# Altium project Moo1.1.PrjPcb
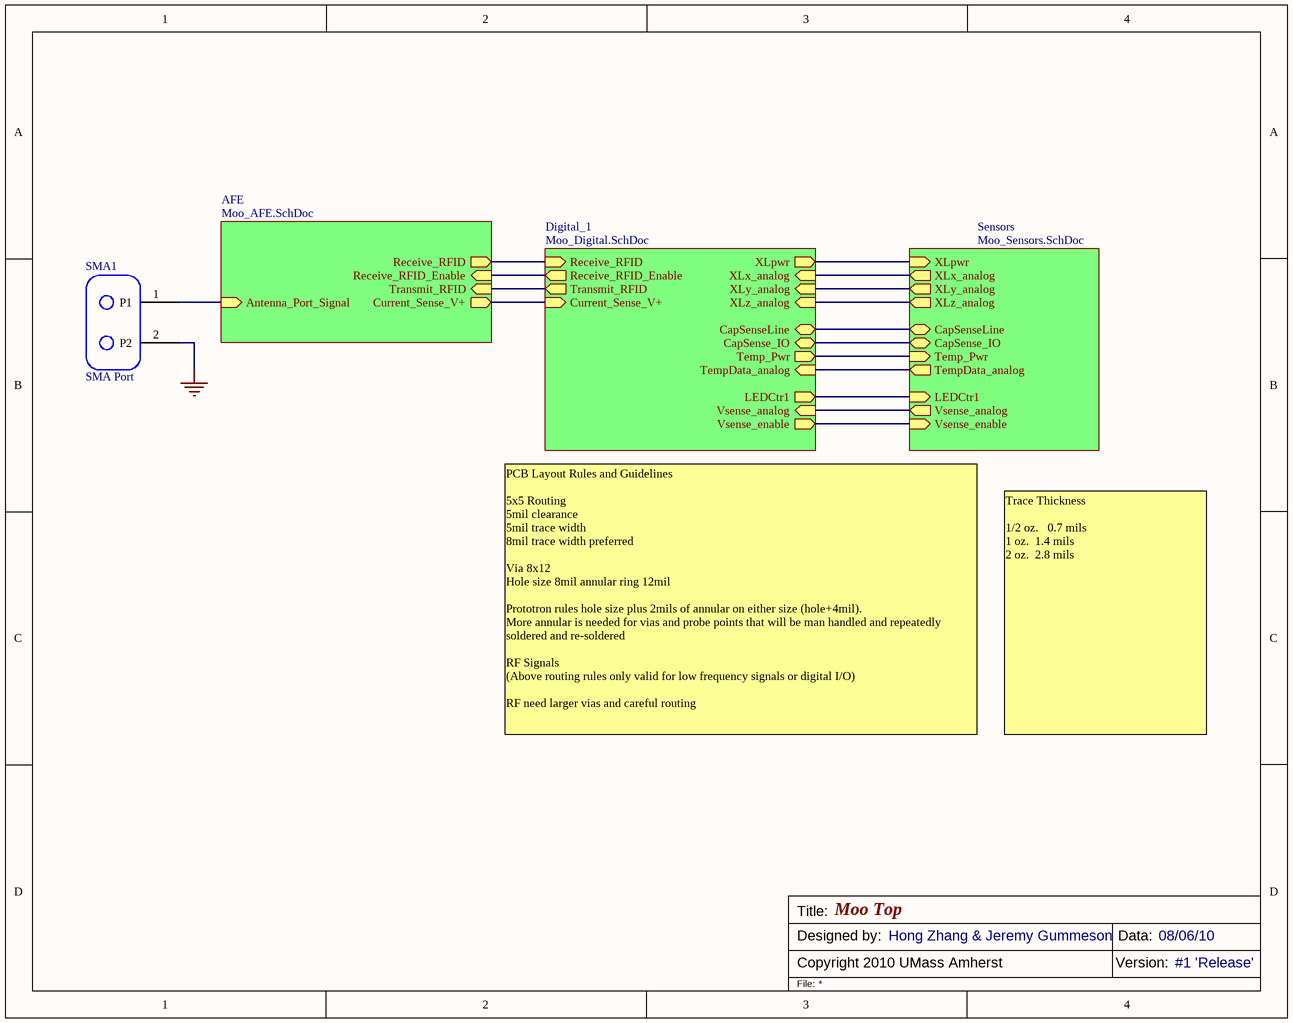
[diagram p0: Moo_Top.SchDoc]
3 sheets, 39 parts. Net scope: hierarchical (ports join the sheet entries above them; power ports are global).
Board files: Moo1.1.PcbDoc, Moo1.1_Ant.PcbDoc
Sheets:
  Moo_Top.SchDoc
    Sensors = Moo_Sensors.SchDoc
    Digital_1 = Moo_Digital.SchDoc

## Sheet Moo_Top.SchDoc
size A; Date: 7/01/09; Engineer: Alanson Sample & Dan Yeager; Revision: Release

### Parts
SMA1  SMA Port  [SMA Port]

### Sub-sheets
AFE = Moo_AFE.SchDoc (file not in this document): Receive_RFID (out), Receive_RFID_Enable (in), Transmit_RFID (in), Antenna_Port_Signal (in), Current_Sense_V+ (out)
Digital_1 = Moo_Digital.SchDoc: Receive_RFID (in), Receive_RFID_Enable (out), Transmit_RFID (out), XLpwr (out), XLx_analog (in), XLy_analog (in), XLz_analog (in), LEDCtr1 (out), Vsense_analog (in), Temp_Pwr (out), TempData_analog (in), CapSense_IO (bidir), Vsense_enable (out), CapSenseLine (bidir), Current_Sense_V+ (in)
Sensors = Moo_Sensors.SchDoc: XLpwr, XLx_analog (out), XLy_analog (out), XLz_analog (out), TempData_analog (out), Temp_Pwr, LEDCtr1 (in), Vsense_analog (out), CapSense_IO, Vsense_enable (in), CapSenseLine

### Nets
GND: SMA1.2(P2)
CapSense: sheet Sensors/CapSense_IO, sheet Digital_1/CapSense_IO
CapSenseLine: sheet Sensors/CapSenseLine, sheet Digital_1/CapSenseLine
LED_CTL_1: sheet Sensors/LEDCtr1, sheet Digital_1/LEDCtr1
P63_A3: sheet Sensors/TempData_analog, sheet Digital_1/TempData_analog
P64_A4: sheet Sensors/Vsense_analog, sheet Digital_1/Vsense_analog
Temp_Pwr: sheet Sensors/Temp_Pwr, sheet Digital_1/Temp_Pwr
VSENSE_ENABLE: sheet Sensors/Vsense_enable, sheet Digital_1/Vsense_enable
XLpwr: sheet Sensors/XLpwr, sheet Digital_1/XLpwr
XLx: sheet Sensors/XLx_analog, sheet Digital_1/XLx_analog
XLy: sheet Sensors/XLy_analog, sheet Digital_1/XLy_analog
XLz: sheet Sensors/XLz_analog, sheet Digital_1/XLz_analog
NetMCU1_13: sheet AFE/Transmit_RFID, sheet Digital_1/Transmit_RFID
NetMCU1_14: sheet AFE/Receive_RFID, sheet Digital_1/Receive_RFID
NetMCU1_15: sheet AFE/Receive_RFID_Enable, sheet Digital_1/Receive_RFID_Enable
NetP3_1: sheet AFE/Current_Sense_V+, sheet Digital_1/Current_Sense_V+
NetSMA1_1: SMA1.1(P1) ; sheet AFE/Antenna_Port_Signal

### Notes on the sheet
- PCB Layout Rules and Guidelines
  5x5 Routing
  5mil clearance
  5mil trace width
  8mil trace width preferred
  Via 8x12
  Hole size 8mil annular ring 12mil
  Prototron rules hole size plus 2mils of annular on either size (hole+4mil).
  More annular is needed for vias and probe points that will be man handled and repeatedly soldered and re-soldered
  RF Signals
  (Above routing rules only valid for low frequency signals or digital I/O)
  RF need larger vias and careful routing
- Trace Thickness
  1/2 oz.  	0.7 mils
  1 oz. 	1.4 mils
  2 oz. 	2.8 mils
- Title:
- Copyright 2010 UMass Amherst
- Designed by:
- Moo Top
- Hong Zhang & Jeremy Gummeson
- Version:
- Data:
- 08/06/10
- #1 'Release'
- File:

### Library data of the parts
SMA1 = SMA Port: Two pin SMA connector wisp; Value: Do Not Stuff

## Sheet Moo_Sensors.SchDoc
size A
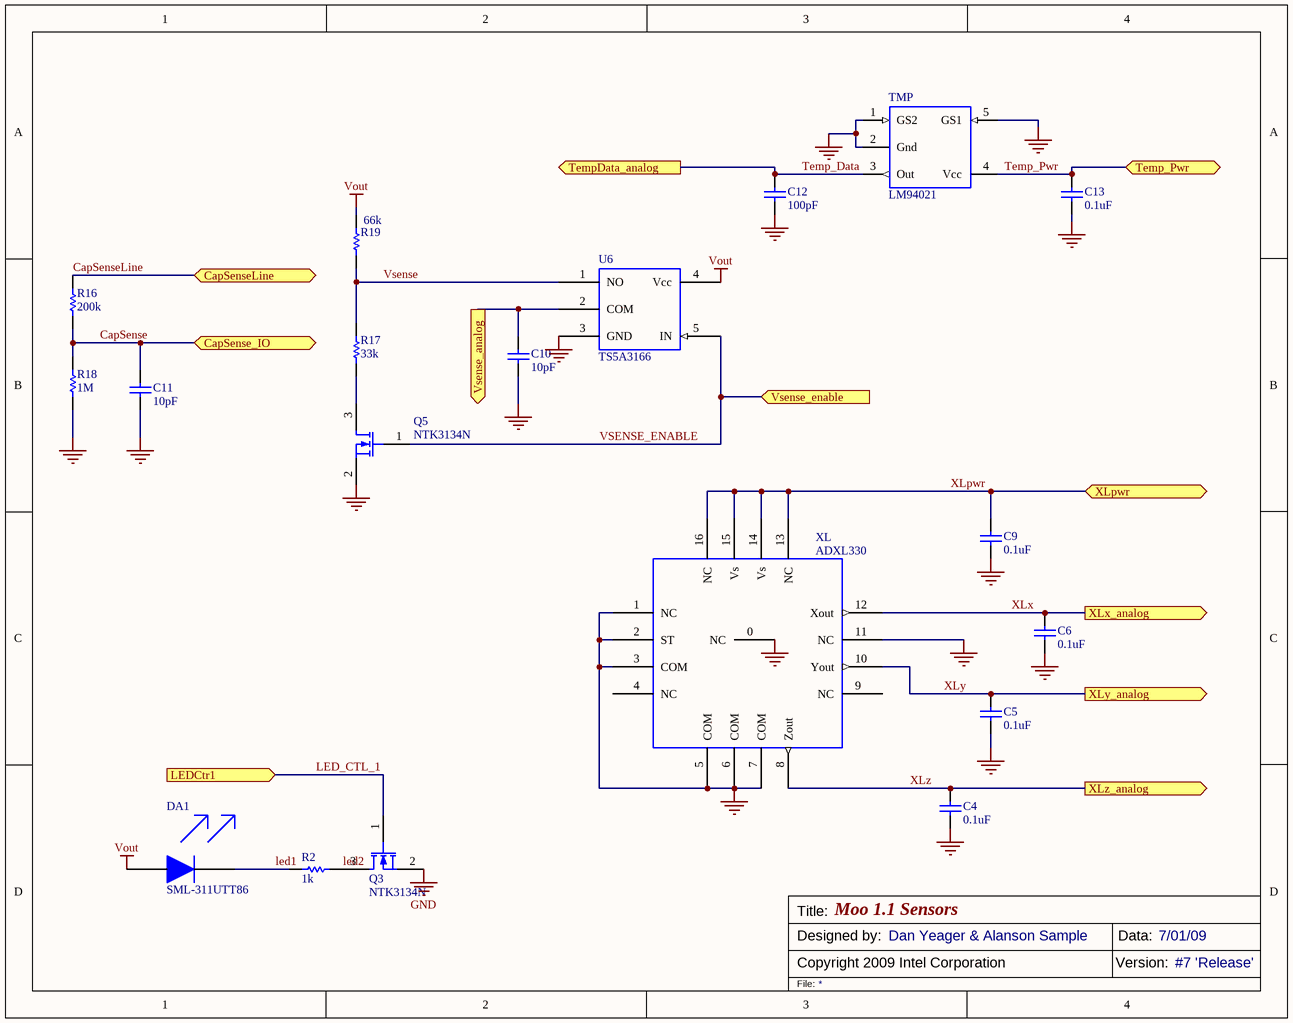
[diagram p1: Moo_Sensors.SchDoc]

### Parts
C4  value 0.1uF  [0402]  (hidden comment: Ceramic_Chip_Capacitor)
C5  value 0.1uF  [0402]  (hidden comment: Ceramic_Chip_Capacitor)
C6  value 0.1uF  [0402]  (hidden comment: Ceramic_Chip_Capacitor)
C9  value 0.1uF  [0402]  (hidden comment: Ceramic_Chip_Capacitor)
C10  value 10pF  [0402]  (hidden comment: Ceramic_Chip_Capacitor)
C11  value 10pF  [0402]  (hidden comment: Ceramic_Chip_Capacitor)
C12  value 100pF  [0402]  (hidden comment: Ceramic_Chip_Capacitor)
C13  value 0.1uF  [0402]  (hidden comment: Ceramic_Chip_Capacitor)
DA1  SML-311UTT86  [LED-0603]
Q3  NTK3134N  [SOT723]
Q5  NTK3134N  [SOT723]
R2  value 1k  [0402]  (hidden comment: Thick Film Chip Resistor)
R16  value 200k  [0402]  (hidden comment: Thick Film Chip Resistor)
R17  value 33k  [0402]  (hidden comment: Thick Film Chip Resistor)
R18  value 1M  [0402]  (hidden comment: Thick Film Chip Resistor)
R19  value 66k  [0402]  (hidden comment: Thick Film Chip Resistor)
TMP  LM94021  [SC70]
U6  TS5A3166  [sc70-5]
XL  ADXL330  [16-QFN]

### Ports
CapSense_IO, CapSenseLine, LEDCtr1 (in), Temp_Pwr, TempData_analog (out), Vsense_analog (out), Vsense_enable (in), XLpwr, XLx_analog (out), XLy_analog (out), XLz_analog (out)

### Nets
GND: C4.1 C5.1 C6.2 C9.1 C10.2 C11.2 C12.1 C13.1 Q3.2(S) Q5.2(S) R18.2 TMP.1(GS2) TMP.2(Gnd) TMP.5(GS1) U6.3(GND) XL.0(NC) XL.1(NC) XL.2(ST) XL.3(COM) XL.5(COM) XL.6(COM) XL.7(COM) XL.11(NC)
Vout: DA1.1 R19.1 U6.4(Vcc)
CapSense: C11.1 R16.2 R18.1 ; port CapSense_IO
CapSenseLine: R16.1 ; port CapSenseLine
led1: DA1.2 R2.1
led2: Q3.3(D) R2.2
LED_CTL_1: Q3.1(G) ; port LEDCtr1
P64_A4: C10.1 U6.2(COM) ; port Vsense_analog
Temp_Data: C12.2 TMP.3(Out) ; port TempData_analog  [project net P63_A3]
Temp_Pwr: C13.2 TMP.4(Vcc) ; port Temp_Pwr
Vsense: R17.1 R19.2 U6.1(NO)
VSENSE_ENABLE: Q5.1(G) U6.5(IN) ; port Vsense_enable
XLpwr: C9.2 XL.13(NC) XL.14(Vs) XL.15(Vs) XL.16(NC) ; port XLpwr
XLx: C6.1 XL.12(Xout) ; port XLx_analog
XLy: C5.2 XL.10(Yout) ; port XLy_analog
XLz: C4.2 XL.8(Zout) ; port XLz_analog
NetQ5_3: Q5.3(D) R17.2

Not connected (* = marked no-connect by the designer): XL 4(NC) 9(NC)

### Notes on the sheet
- Title:
- Copyright 2009 Intel Corporation
- Designed by:
- Moo 1.1 Sensors
- Dan Yeager & Alanson Sample
- Version:
- Data:
- 7/01/09
- #7 'Release'
- File:

### Library data of the parts
C4-C6 C9 C10 C12 C13 = Ceramic_Chip_Capacitor: Ceramic Capacitor - Standard; Note: Footprint corresponds to dimensions for bulk cassette packaging. This case size has tightened tolerances.
C11 = Ceramic_Chip_Capacitor: Ceramic Capacitor - Standard; Note: Do Not Stuff
DA1 = SML-311UTT86: LED 630NM RED WTR CLR 0603 SMD
Q3 Q5 = NTK3134N: Powe Mosfet 20V, 890mA, Single N-channel
R2 R16-R19 = Thick Film Chip Resistor: Note: Do Not Stuff
TMP = LM94021: Temperature Sensor
U6 = TS5A3166: TI Analog Switch 100nA 1ohm Normally Open
XL = ADXL330k: Analog Devices 3D Accelerometer

## Sheet Moo_Digital.SchDoc
size 381 x 241 mm; PageSetup: Record=PageOptions|CenterHorizontal=True|CenterVertical=True|PrintScale=0.70|XCorrection=1.00|YCorrection=1.00|PrintKind=1|BorderSize=5000000|LeftOffset=0|BottomOffset=0|Orientation=2|PaperLength=1000|PaperWidth=1000|Scale=100|PaperSource=15|PrintQuality=600|MediaType=1|DitherType=10|PaperKind=Letter|PrintScaleMode=1
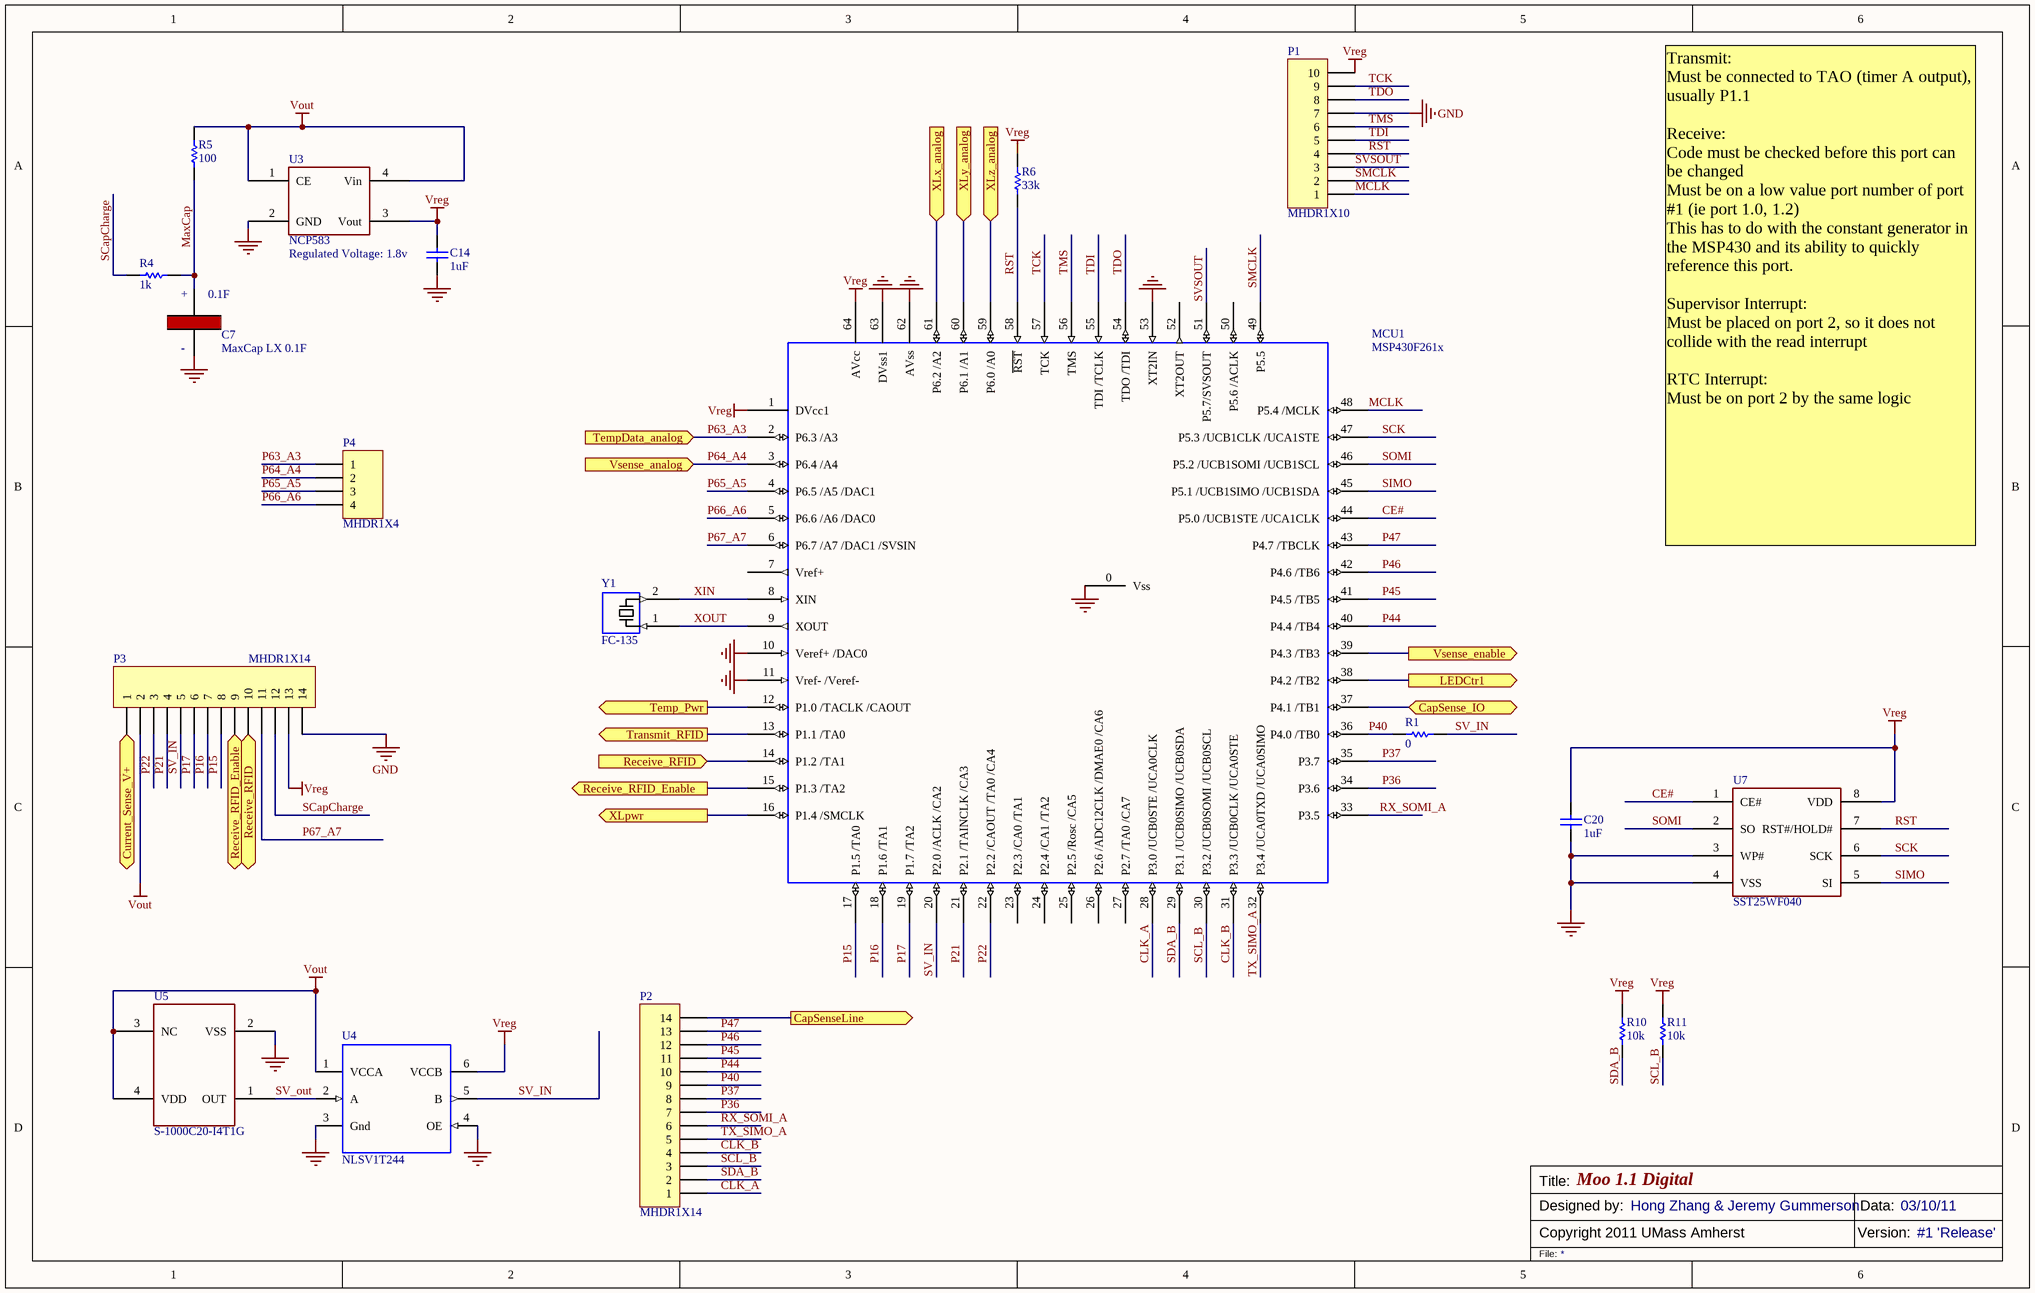
[diagram p2: Moo_Digital.SchDoc]

### Parts
C7  MaxCap LX 0.1F  [Maxcap LX 0.1F]
C14  value 1uF  [0402]  (hidden comment: Ceramic_Chip_Capacitor)
C20  value 1uF  [0402]  (hidden comment: Ceramic_Chip_Capacitor)
MCU1  MSP430F261x  [64-PM]
P1  MHDR1X10  [MHDR1X10]
P2  MHDR1X14  [MHDR1X14]
P3  MHDR1X14  [MHDR1X14]
P4  MHDR1X4  [MHDR1X4]
R1  value 0  [0402]  (hidden comment: Thick Film Chip Resistor)
R4  value 1k  [0402]  (hidden comment: Thick Film Chip Resistor)
R5  value 100  [0402]  (hidden comment: Thick Film Chip Resistor)
R6  value 33k  [0402]  (hidden comment: Thick Film Chip Resistor)
R10  value 10k  [0402]  (hidden comment: Thick Film Chip Resistor)
R11  value 10k  [0402]  (hidden comment: Thick Film Chip Resistor)
U3  NCP583  Regulated Voltage: 1.8v  [SC82-AB]
U4  NLSV1T244  [UDFN6]
U5  S-1000C20-I4T1G  [SNT-4A]
U7  SST25WF040  [SOIC8]
Y1  FC-135  [FC-135]

### Ports
CapSense_IO (bidir), CapSenseLine (out), Current_Sense_V+ (out), LEDCtr1 (out), Receive_RFID, Receive_RFID (in), Receive_RFID_Enable, Receive_RFID_Enable (out), Temp_Pwr (out), TempData_analog (in), Transmit_RFID (out), Vsense_analog (in), Vsense_enable (out), XLpwr (out), XLx_analog (in), XLy_analog (in), XLz_analog (in)

### Nets
GND: C7.2(GND) C14.1 C20.2 MCU1.0(Vss) MCU1.10(Veref+_/DAC0) MCU1.11(Vref-_/Veref-) MCU1.53(XT2IN) MCU1.62(AVss) MCU1.63(DVss1) P1.7 P3.14 U3.2(GND) U4.3(Gnd) U4.4(OE) U5.2(VSS) U7.3(WP#) U7.4(VSS)
Vout: P3.2 R5.2 U3.1(CE) U3.4(Vin) U4.1(VCCA) U5.3(NC) U5.4(VDD)
Vreg: C14.2 C20.1 MCU1.1(DVcc1) MCU1.64(AVcc) P1.10 P3.13 R6.1 R10.1 R11.1 U3.3(Vout) U4.6(VCCB) U7.8(VDD)
CapSense: MCU1.37(P4.1_/TB1) ; port CapSense_IO
CapSenseLine: P2.14 ; port CapSenseLine
CE#: MCU1.44(P5.0_/UCB1STE_/UCA1CLK) U7.1(CE#)
CLK_A: MCU1.28(P3.0_/UCB0STE_/UCA0CLK) P2.1
CLK_B: MCU1.31(P3.3_/UCB0CLK_/UCA0STE) P2.4
LED_CTL_1: MCU1.38(P4.2_/TB2) ; port LEDCtr1
MaxCap: C7.1(Positive) R4.1 R5.1
MCLK: MCU1.48(P5.4_/MCLK) P1.1
P15: MCU1.17(P1.5_/TA0) P3.8
P16: MCU1.18(P1.6_/TA1) P3.7
P17: MCU1.19(P1.7_/TA2) P3.6
P21: MCU1.21(P2.1_/TAINCLK_/CA3) P3.4
P22: MCU1.22(P2.2_/CAOUT_/TA0_/CA4) P3.3
P36: MCU1.34(P3.6) P2.7
P37: MCU1.35(P3.7) P2.8
P40: MCU1.36(P4.0_/TB0) P2.9 R1.2
P44: MCU1.40(P4.4_/TB4) P2.10
P45: MCU1.41(P4.5_/TB5) P2.11
P46: MCU1.42(P4.6_/TB6) P2.12
P47: MCU1.43(P4.7_/TBCLK) P2.13
P63_A3: MCU1.2(P6.3_/A3) P4.1 ; port TempData_analog
P64_A4: MCU1.3(P6.4_/A4) P4.2 ; port Vsense_analog
P65_A5: MCU1.4(P6.5_/A5_/DAC1) P4.3
P66_A6: MCU1.5(P6.6_/A6_/DAC0) P4.4
P67_A7: MCU1.6(P6.7_/A7_/DAC1_/SVSIN) P3.11
RST: MCU1.58(~{RST}) P1.4 R6.2 U7.7(RST#/HOLD#)
RX_SOMI_A: MCU1.33(P3.5) P2.6
SCapCharge: P3.12 R4.2
SCK: MCU1.47(P5.3_/UCB1CLK_/UCA1STE) U7.6(SCK)
SCL_B: MCU1.30(P3.2_/UCB0SOMI_/UCB0SCL) P2.3 R11.2
SDA_B: MCU1.29(P3.1_/UCB0SIMO_/UCB0SDA) P2.2 R10.2
SIMO: MCU1.45(P5.1_/UCB1SIMO_/UCB1SDA) U7.5(SI)
SMCLK: MCU1.49(P5.5) P1.2
SOMI: MCU1.46(P5.2_/UCB1SOMI_/UCB1SCL) U7.2(SO)
SV_IN: MCU1.20(P2.0_/ACLK_/CA2) P3.5 R1.1 U4.5(B)
SV_out: U4.2(A) U5.1(OUT)
SVSOUT: MCU1.51(P5.7/SVSOUT) P1.3
TCK: MCU1.57(TCK) P1.9
TDI: MCU1.55(TDI_/TCLK) P1.5
TDO: MCU1.54(TDO_/TDI) P1.8
Temp_Pwr: MCU1.12(P1.0_/TACLK_/CAOUT) ; port Temp_Pwr
TMS: MCU1.56(TMS) P1.6
TX_SIMO_A: MCU1.32(P3.4_/UCA0TXD_/UCA0SIMO) P2.5
VSENSE_ENABLE: MCU1.39(P4.3_/TB3) ; port Vsense_enable
XIN: MCU1.8(XIN) Y1.2
XLpwr: MCU1.16(P1.4_/SMCLK) ; port XLpwr
XLx: MCU1.61(P6.2_/A2) ; port XLx_analog
XLy: MCU1.60(P6.1_/A1) ; port XLy_analog
XLz: MCU1.59(P6.0_/A0) ; port XLz_analog
XOUT: MCU1.9(XOUT) Y1.1
NetMCU1_13: MCU1.13(P1.1_/TA0) ; port Transmit_RFID
NetMCU1_14: MCU1.14(P1.2_/TA1) P3.10 ; port Receive_RFID
NetMCU1_15: MCU1.15(P1.3_/TA2) P3.9 ; port Receive_RFID_Enable
NetP3_1: P3.1 ; port Current_Sense_V+

Not connected (* = marked no-connect by the designer): MCU1 7(Vref+) 23(P2.3_/CA0_/TA1) 24(P2.4_/CA1_/TA2) 25(P2.5_/Rosc_/CA5) 26(P2.6_/ADC12CLK_/DMAE0_/CA6) 27(P2.7_/TA0_/CA7) 50(P5.6_/ACLK) 52(XT2OUT)

### Notes on the sheet
- Transmit:
  Must be connected to TAO (timer A output), usually P1.1
  Receive:
  Code must be checked before this port can be changed
  Must be on a low value port number of port #1 (ie port 1.0, 1.2)
  This has to do with the constant generator in the MSP430 and its ability to quickly reference this port.
  Supervisor Interrupt:
  Must be placed on port 2, so it does not collide with the read interrupt
  RTC Interrupt:
  Must be on port 2 by the same logic
- Title:
- Copyright 2011 UMass Amherst
- Designed by:
- Moo 1.1 Digital
- Hong Zhang & Jeremy Gummerson
- Version:
- Data:
- 03/10/11
- #1 'Release'
- File:
- (in symbol MaxCap LX 0.1F) +; 0.1F; -

### Library data of the parts
C7 = MaxCap LX 0.1F: MaxCap LX 0.1F, low leakage supper cap 5.5v
C14 C20 = Ceramic_Chip_Capacitor: as C4 on sheet Moo_Sensors
MCU1 = MSP430F261x: 64PM MSP430F261x
P1 = MHDR1X10: Header, 10-Pin; LatestRevisionDate: 17-Jul-2002; LatestRevisionNote: Re-released for DXP Platform.; Publisher: Altium Limited
P2 P3 = MHDR1X14: Header, 14-Pin; LatestRevisionDate: 17-Jul-2002; LatestRevisionNote: Re-released for DXP Platform.; Publisher: Altium Limited
P4 = MHDR1X4: Header, 4-Pin; LatestRevisionDate: 17-Jul-2002; LatestRevisionNote: Re-released for DXP Platform.; Publisher: Altium Limited
R1 R5 R6 R10 R11 = Thick Film Chip Resistor: Note: Do Note Stuff
R4 = Thick Film Chip Resistor: Note: Do Not Stuff
U3 = NCP583: Ultra-Low Iq 150mA CMOS LDO Regulator with Enable
U4 = NLSV1T244: Level Shifter: 1-Bit Dual-Supply Non-Inverting Level Translator; Part Number: ADG3301; DNS: Do Not Stuff Part
U5 = S-1000C20-I4T
U7 = SST25WF040: Serial Flash Memory - 8 Lead SOIC Package

## Nets that join several sheets
GND: Moo_Top (SMA1.2), Moo_Sensors (23 pins), Moo_Digital (17 pins)
Vout: Moo_Sensors (DA1.1 R19.1 U6.4), Moo_Digital (7 pins)
CapSense: Moo_Sensors (C11.1 R16.2 R18.1), Moo_Digital (MCU1.37)
CapSenseLine: Moo_Sensors (R16.1), Moo_Digital (P2.14)
LED_CTL_1: Moo_Sensors (Q3.1), Moo_Digital (MCU1.38)
P63_A3: Moo_Sensors (C12.2 TMP.3), Moo_Digital (MCU1.2 P4.1)
P64_A4: Moo_Sensors (C10.1 U6.2), Moo_Digital (MCU1.3 P4.2)
Temp_Pwr: Moo_Sensors (C13.2 TMP.4), Moo_Digital (MCU1.12)
VSENSE_ENABLE: Moo_Sensors (Q5.1 U6.5), Moo_Digital (MCU1.39)
XLpwr: Moo_Sensors (5 pins), Moo_Digital (MCU1.16)
XLx: Moo_Sensors (C6.1 XL.12), Moo_Digital (MCU1.61)
XLy: Moo_Sensors (C5.2 XL.10), Moo_Digital (MCU1.60)
XLz: Moo_Sensors (C4.2 XL.8), Moo_Digital (MCU1.59)